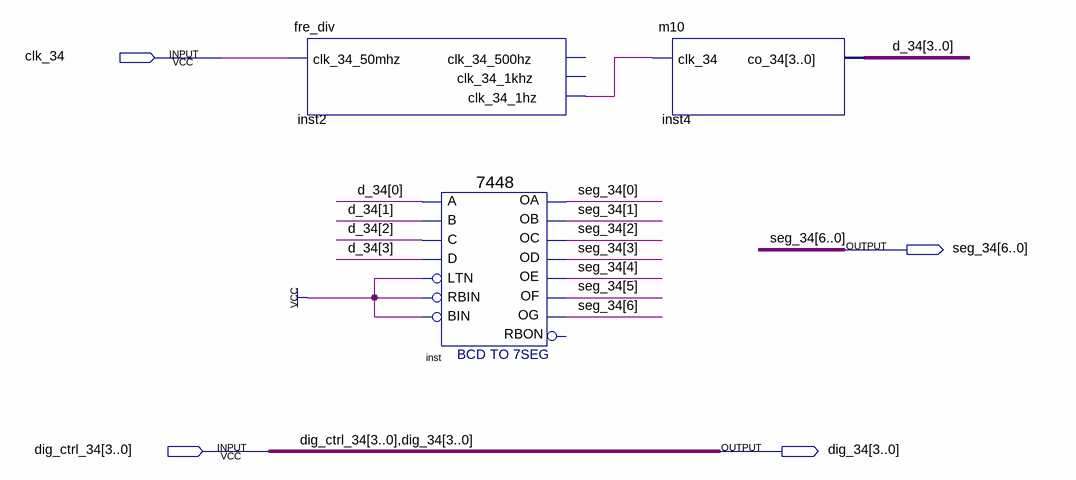
[diagram p0: schematic sheet]
// Quartus schematic demo2_34.bdf as structural Verilog: 3 symbols, 4 pins
module demo2_34 (
  input  clk_34,
  input  [3:0] dig_ctrl_34,
  output [6:0] seg_34,
  output [3:0] dig_34
);

  wire inst2_clk_34_1hz;
  wire [3:0] d_34;

  fre_div inst2 (.clk_34_50mhz(clk_34), .clk_34_1hz(inst2_clk_34_1hz));  // open: clk_34_500hz, clk_34_1khz
  \7448  inst (
    .A(d_34[0]), .C(d_34[2]), .D(d_34[3]), .B(d_34[1]), .RBIN(1'b1), .BIN(1'b1), .LTN(1'b1), .OC(seg_34[2]),
    .OE(seg_34[4]), .OD(seg_34[3]), .OF(seg_34[5]), .OG(seg_34[6]), .OB(seg_34[1]), .OA(seg_34[0]));  // open: RBON
  m10 inst4 (.clk_34(inst2_clk_34_1hz), .co_34(d_34));
endmodule
